# Altium schematic sheet MODULE PINOUT WIFI LAMP CONTROL.SchDoc
size A4
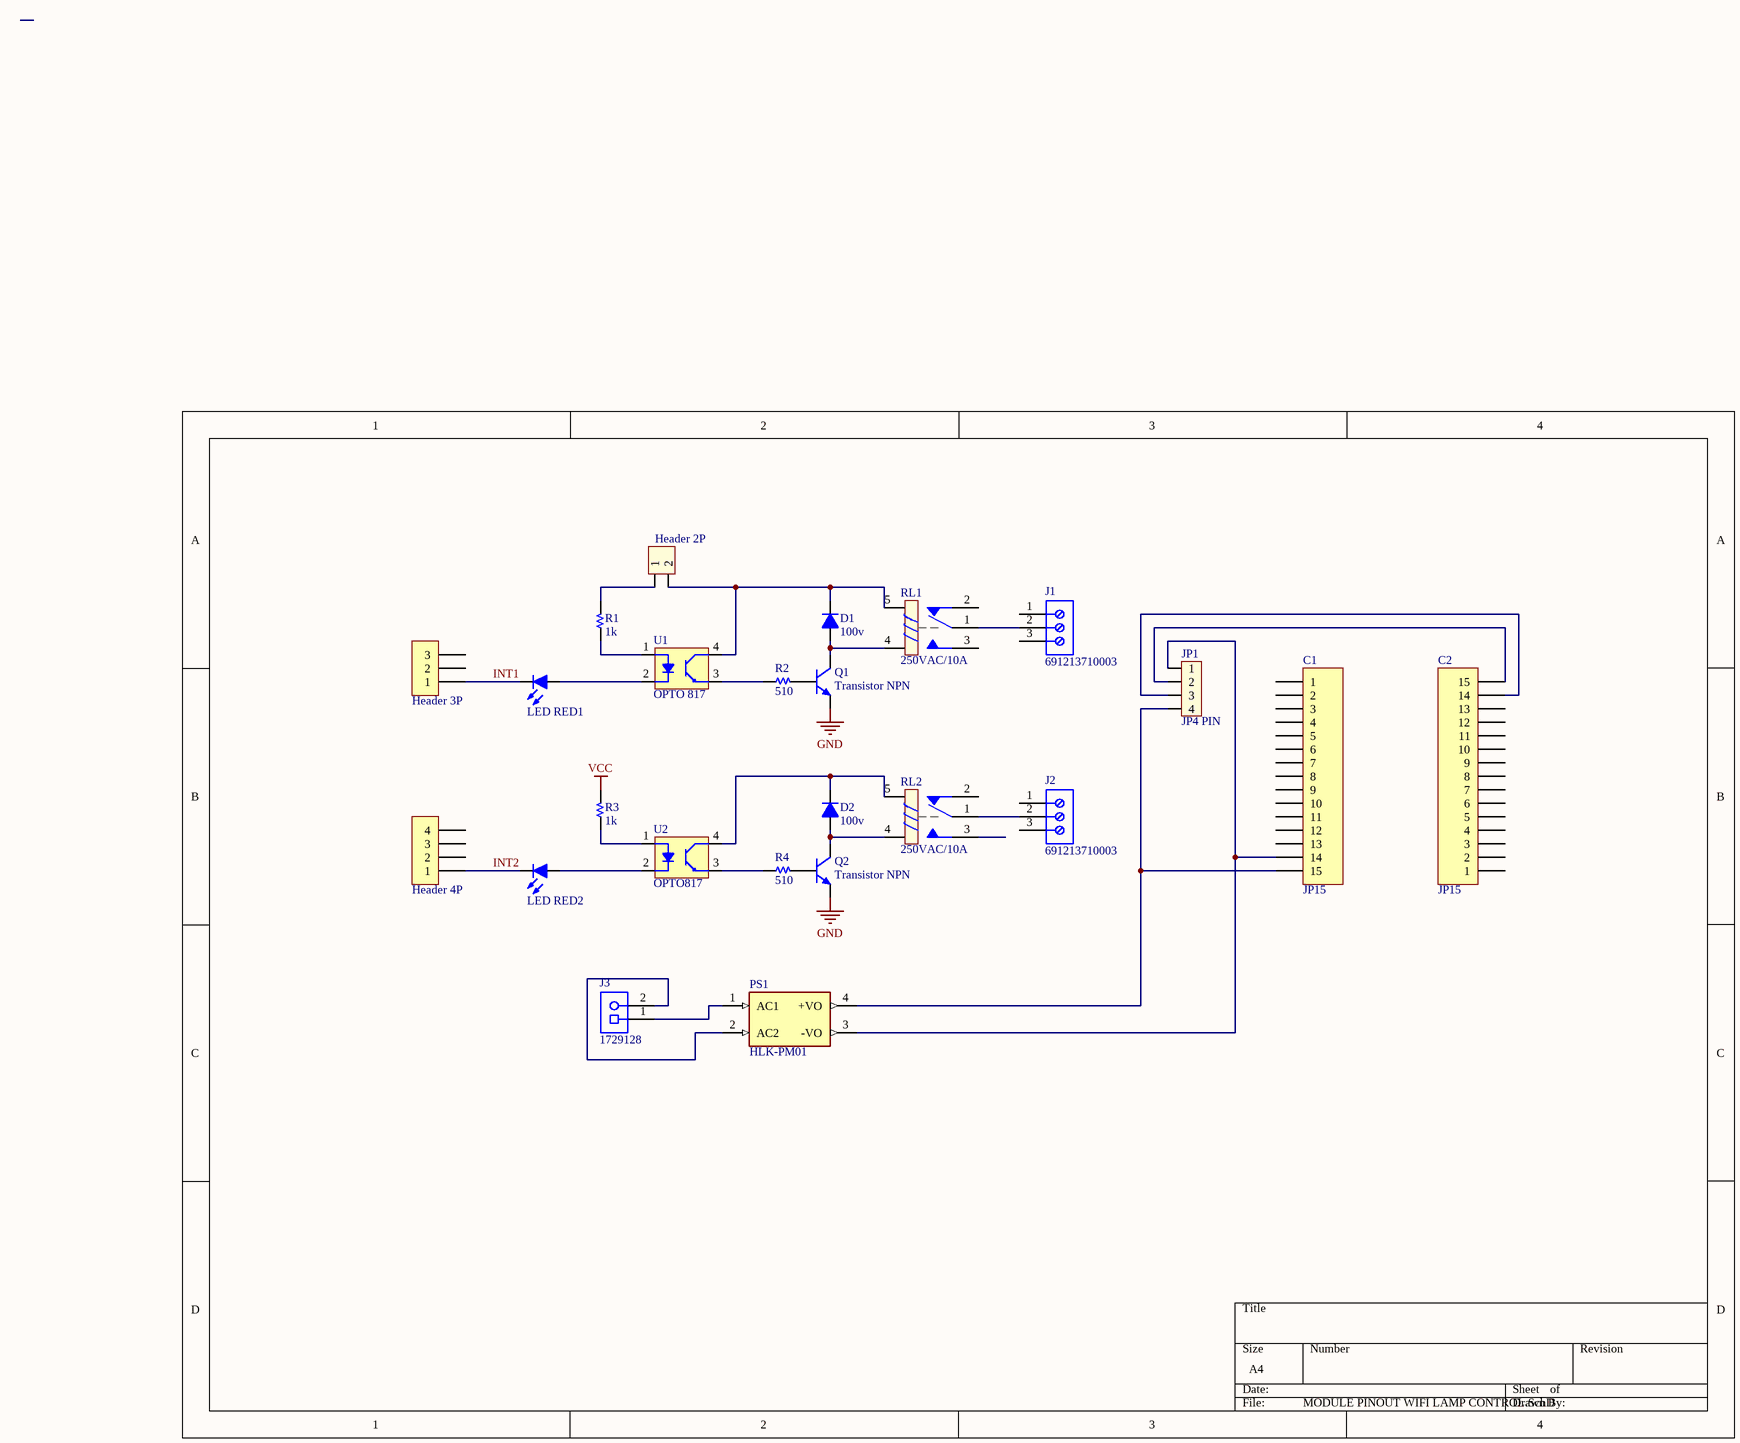
[diagram p0: MODULE PINOUT WIFI LAMP CONTROL.SchDoc]

## Parts
C1  JP15  [JP15-C1T]
C2  JP15  [JP15-C1T]
D1  100v  [DIODE 0.5A]
D2  100v  [DIODE 0.5A]
H1  Header 2P  [XH2.54M-2]
H2  Header 3P  [XH2.54M-3]
H3  Header 4P  [XH2.54M-4]
J1  691213710003  [691213710003]
J2  691213710003  [691213710003]
J3  1729128  [PHOE-1729128-2_V]
JP1  JP4 PIN  [JP4]
LED_RED1  LED RED  [LED 5MM - RED]  (value not drawn)
LED_RED2  LED RED  [LED 5MM - RED]  (value not drawn)
PS1  HLK-PM01  [CONV_HLK-PM01]
Q1  Transistor NPN  [SOT-23]
Q2  Transistor NPN  [SOT-23]
R1  1k  [R 1/4W/300]
R2  510  [R 1/4W/300]
R3  1k  [R 1/4W/300]
R4  510  [R 1/4W/300]
RL1  250VAC/10A  [Relay 5 Chan SRD]
RL2  250VAC/10A  [Relay 5 Chan SRD]
U1  OPTO 817  [DIP4 - PC817]
U2  OPTO817  [DIP4 - PC817]

## Nets
GND: Q1.2(E) Q2.2(E)
VCC: R3.2
INT1: H2.1 LED_RED1.2(K)
INT2: H3.1 LED_RED2.2(K)
NetC1_14: C1.14 JP1.1 PS1.3(-VO)
NetC1_15: C1.15 JP1.4 PS1.4(+VO)
NetC2_14: C2.14 JP1.3
NetC2_15: C2.15 JP1.2
NetD1_1: D1.1(A) Q1.3(C) RL1.4
NetD1_2: D1.2(K) H1.2 RL1.5 U1.4(C)
NetD2_1: D2.1(A) Q2.3(C) RL2.4
NetD2_2: D2.2(K) RL2.5 U2.4(C)
NetH1_1: H1.1 R1.2
NetJ1_2: J1.2 RL1.1
NetJ2_2: J2.2 RL2.1
NetJ3_1: J3.1 PS1.1(AC1)
NetJ3_2: J3.2 PS1.2(AC2)
NetLED_RED1_1: LED_RED1.1(A) U1.2(K)
NetLED_RED2_1: LED_RED2.1(A) U2.2(K)
NetQ1_1: Q1.1(B) R2.2
NetQ2_1: Q2.1(B) R4.2
NetR1_1: R1.1 U1.1(A)
NetR2_1: R2.1 U1.3(E)
NetR3_1: R3.1 U2.1(A)
NetR4_1: R4.1 U2.3(E)

Not connected (* = marked no-connect by the designer): C1 1 2 3 4 5 6 7 8 9 10 11 12 13; C2 1 2 3 4 5 6 7 8 9 10 11 12 13; H2 2 3; H3 2 3 4; J1 1 3; J2 1 3; RL1 2 3; RL2 2 3

## Library data of the parts
C1 C2 = JP15: WR-PHD 2.54 mm Angled Socket Header; Manufacturer: W¨¹rth Elektronik eiSos GmbH; partNo: 613015143121; ComponentLink1 Description: Manufacturer; ComponentLink2 Description: Datasheet; NoPins: 15; Created Date: 29 March 2013; ComponentLink1URL: http://www.we-online.com; ComponentLink2URL: http://katalog.we-online.de/em/datasheet/6130xx143121.pdf; Created by: Karrer Zheng
D1 D2 = Diode 1N4148: Cắm; Ten_Linh_Kien: Diode 1N4148 DO35 450mA 100V ( 1N4148 DIP); Don_Vi: Con; Ma_Hang: MH001065; Ghi Chu: *; Kieu_Chan: *; Chung_Loai: Cắm
H1 = Header 2P 2.54 Duc Thang: Cắm; Ten_Linh_Kien: Header 2P XH2.54-2P Đực Thẳng; Don_Vi: Con; Ma_Hang: MH001283; Chung_Loai: Cắm
H2 = Header 3P 2.54 Duc Thang: Cắm; Ten_Linh_Kien: Header 3P XH2.54-3P Đực Thẳng; Don_Vi: Con; Ma_Hang: MH001292; Chung_Loai: Cắm
H3 = Header 4P 2.54 Duc Thang: Cắm; Ten_Linh_Kien: Header 4P XH2.54-4P Đực Thẳng; Don_Vi: Con; Ma_Hang: MH001285; Chung_Loai: Cắm
J1 J2 = CMP-1502-02527-2: NexarPartId: 8917719; Number of Contacts: 3; Wire/Cable Gauge: 16AWG; Wire Gauge (Max): 26AWG; Connector Type: PCB, Terminal Block; Number of Levels: 1; Plating: Brass, Steel; Current: 10A; Voltage: 300V; Stripping Length: -7mm; Pitch: 5.0038mm; REACH SVHC: Unknown; Mount: Through Hole; Max Operating Temperature: 105°C; Contact Plating: Tin; Termination: Screw; Contact Material: Brass; Housing Material: Nylon; Color: Green; RoHS: Compliant; Wire Gauge (Min): 16AWG; Min Operating Temperature: -40°C; Length: 8.3mm; Packaging: Box; Number of Pins: 3; Lead Pitch: 5mm; Number of Positions Per Level: 3; Height: 10mm; Width: 15.6mm
J3 = CMP-2000-05815-1: PCB Terminal Block, 13.5 A, 400 V, 2-Pin THD, RoHS, Bulk; Manufacturer: Phoenix Contact; Package Version: 03/2015; No. of Rows: 1; Pitch: 5.08mm; No. of Positions: 2; Voltage Rating: 400V; Current Rating: 13500mA; Manufacturer URL: http://www.phoenixcontact.com/; Datasheet URL: https://datasheet.ciiva.com/16046/1729128-16046181.pdf; RoHS: TRUE; Package URL: https://www.phoenixcontact.com/online/portal/pi/pxc/product_detail_page/!ut/p/b1/3VdJjqNKFDxLH8AFycySyWY2ozFsEPOMMQaDOX1XedGL_1Vdm5YXJleknhSKeBkvI6EA8ncAo3AYoDhBQGco6KN7VURTdemj9us_IEKEZo_YHiPAEWEFmDGOHMORkqKYCORBZxgL7ZoaZYcbFFUZ3fqxSY6GOuxydWUuHqz1ynmMFygu583Bob0Ewr6Sd_l-5m-kAueHiB0jpRwZwe58wwtkpxtMYd_LmGcDRU02dRNEyWt6Y2ti5pSyJ_reIkzIulrqApdnbT11V5jnCKbYNCvhEM1MCpPByat_X379-iThf08CI5GfOPqfBeS3BRoBOdD55AKVv0iLwCMq-2BrzXWSGRH7pUGD9uwXQjiph3xL0DKQwdGa0JImiIOmBNOestqgwTHSSs2oOep-78apyXQBvNi8ZLaFjvjWvcaUEBu0MC6Wbe-d6mB0FAebo2lUWinqYaZs5DAYzV0RP9yitUjnGJ0iI9xhZkT42OCQNUJJhkgWINNQLP2JFP6OpMg3JCVg70jqHT0lvKOnhHf0lPuOnnLf0VPuWx6_dxwUIvwk5WMkT0kLL1mh61l2yZVSzG3pYV_bqo-mj6uMKwKwdnnW8Jh5RTOJzMOA5c-eJDaZQw4mTMPH02PvS_ZAqNVjVTo2WyYLkwH_KU1mmmG5kjRhDqPXLwwVHvVOjCM60-fpXvTDfMGW1PVFVS1r4e4yVDk4ZdNbkUHvqPqQSeian4UD39fNKmachqdJ1NJbyk8rXT9mXTvPk3oE5meulKGgiruPJek-4I9hTT6G8ZLOyRSm2RRVbThERQad5OS28hdt4YW4vG0stgYYzsWsK4_7y6DZMjJSCqri1kyiZR5vD7pwIrNR7QwPHTcLTI5qT7eRlpHrdGiupYlqQDJ7zy_CND8fWWBoLRXxk1RVcXiBQwbTD4Xi7KL-FuO94t9xaqweXzH; PartNumber: 1729128; Package Description: 2-Pin Through Hole Device, Body 8.1 x 10.16 mm, Pitch 5.08 mm; Datasheet Version: 12/2013; Mounting Technology: ThroughHole; Orientation: Horizontal; Package Reference: 1729128-2; Packing: Bulk
JP1 = JP4: Value: JP4
LED_RED1 LED_RED2 = Led: Typical LED
PS1 = HLK-PM01: The HLK-PM01 is a small size low cost AC to DC converter which can take in 110V/220V AC at 50/60 Hz and give 5V 3W output. The module is can be used in designs which run on 5V and needs to be powered form the AC mains.; MF: Hi-link; SnapEDA_Link: https://www.snapeda.com/parts/hlk-pm01/Hi-link/view-part/?ref=snap; Package: None; Value: *; MP: hlk-pm01; Check_prices: https://www.snapeda.com/parts/hlk-pm01/Hi-link/view-part/?ref=eda
Q1 Q2 = Transistor NPN: NPN Bipolar Transistor
R1-R4 = Resistor
RL1 RL2 = Relay 5 Chan SRD: Relay 5 Chan; Ma_Hang: MH009374; Ten: Relay 5V10A SRD-05VDC-SL-C Chính Hãng
U1 U2 = PC817: Opto PC817B